# Altium schematic sheet SoftRobotController.SchDoc: Soft Robotic Actuator Controller
size B; DrawnBy: Logan Greif; Engineer: Logan Greif; SheetNumber: 1; SheetTotal: 1
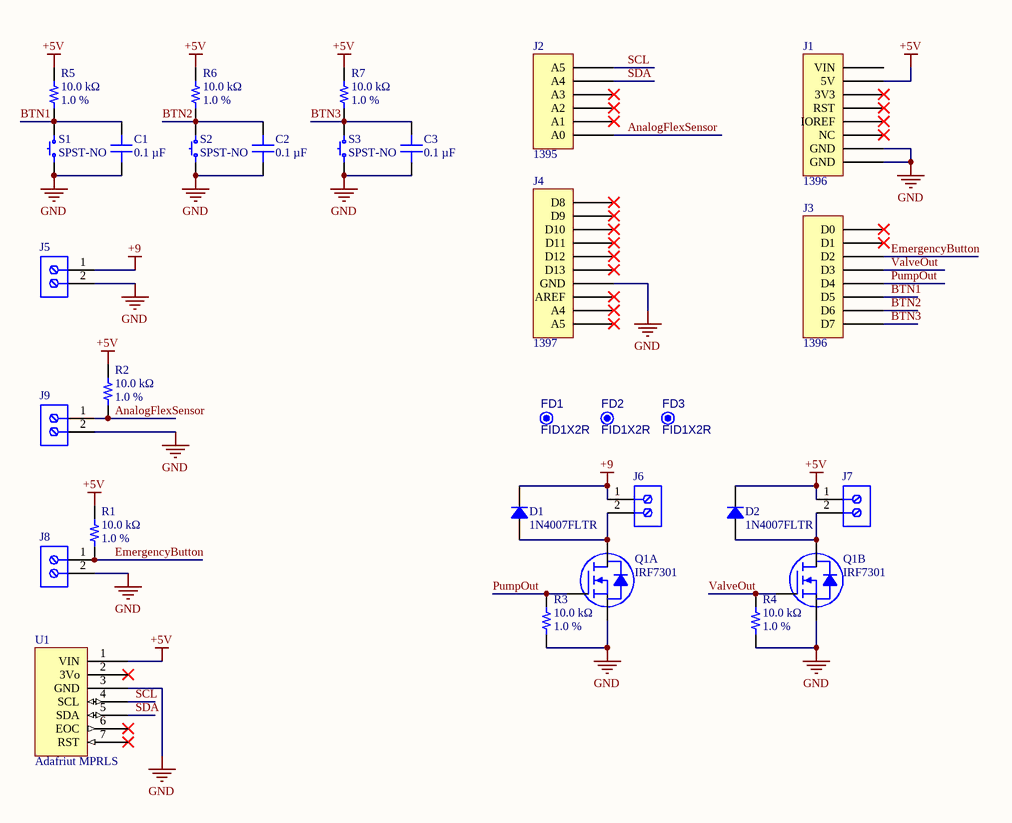
[diagram p0: SoftRobotController.SchDoc]

## Parts
C1  0.1 µF  [CAP 0603_1608]
C2  0.1 µF  [CAP 0603_1608]
C3  0.1 µF  [CAP 0603_1608]
D1  1N4007FLTR  [SOD123F]
D2  1N4007FLTR  [SOD123F]
FD1  FID1X2R  [FID1X2R]  (no BOM)
FD2  FID1X2R  [FID1X2R]  (no BOM)
FD3  FID1X2R  [FID1X2R]  (no BOM)
J1  1396  [PCB - CONNECTOR - HEADER - MALE 1X8]
J2  1395  [PCB - CONNECTOR - HEADER - MALE 1X6]
J3  1396  [PCB - CONNECTOR - HEADER - MALE 1X8]
J4  1397  [PCB - CONNECTOR - HEADER - MALE 1X10]
J5  691103110002  [691103110002]  (value not drawn)
J6  691103110002  [691103110002]  (value not drawn)
J7  691103110002  [691103110002]  (value not drawn)
J8  691103110002  [691103110002]  (value not drawn)
J9  691103110002  [691103110002]  (value not drawn)
Q1  IRF7301  [IRF7301]  (parts A,B of 2)
R1  10.0 kΩ  Tolerance: 1.0 %  [PCB - RESISTOR - CHIP - RES 0603_1608]
R2  10.0 kΩ  Tolerance: 1.0 %  [PCB - RESISTOR - CHIP - RES 0603_1608]
R3  10.0 kΩ  Tolerance: 1.0 %  [PCB - RESISTOR - CHIP - RES 0603_1608]
R4  10.0 kΩ  Tolerance: 1.0 %  [PCB - RESISTOR - CHIP - RES 0603_1608]
R5  10.0 kΩ  Tolerance: 1.0 %  [PCB - RESISTOR - CHIP - RES 0603_1608]
R6  10.0 kΩ  Tolerance: 1.0 %  [PCB - RESISTOR - CHIP - RES 0603_1608]
R7  10.0 kΩ  Tolerance: 1.0 %  [PCB - RESISTOR - CHIP - RES 0603_1608]
S1  SPST-NO  [PTS641SK31SMTR2LFS]
S2  SPST-NO  [PTS641SK31SMTR2LFS]
S3  SPST-NO  [PTS641SK31SMTR2LFS]
U1  Adafriut MPRLS  [ADAFRUITMPRLS]

## Nets
+5V: D2.2 J1.5(5V) J7.1 R1.2 R2.2 R5.2 R6.2 R7.2 U1.1(VIN)
+9: D1.2 J5.1 J6.1
GND: C1.1 C2.1 C3.1 J1.6(GND) J1.7(GND) J4.7(GND) J5.2 J8.2 J9.2 Q1.1(S1) Q1.3(S2) R3.1 R4.1 S1.1 S1.2 S2.1 S2.2 S3.1 S3.2 U1.3(GND)
AnalogFlexSensor: J2.6(A0) J9.1 R2.1
BTN1: C1.2 J3.6(D5) R5.1 S1.3 S1.4
BTN2: C2.2 J3.7(D6) R6.1 S2.3 S2.4
BTN3: C3.2 J3.8(D7) R7.1 S3.3 S3.4
EmergencyButton: J3.3(D2) J8.1 R1.1
PumpOut: J3.5(D4) Q1.2(G1) R3.2
SCL: J2.1(A5) U1.4(SCL)
SDA: J2.2(A4) U1.5(SDA)
ValveOut: J3.4(D3) Q1.4(G2) R4.2
NetD1_1: D1.1 J6.2 Q1.7(D1) Q1.8(D1)
NetD2_1: D2.1 J7.2 Q1.5(D2) Q1.6(D3)

Not connected (* = marked no-connect by the designer): J1 1(NC)* 2(IOREF)* 3(RST)* 4(3V3)* 8(VIN); J2 3(A3)* 4(A2)* 5(A1)*; J3 1(D0)* 2(D1)*; J4 1(D8)* 2(D9)* 3(D10)* 4(D11)* 5(D12)* 6(D13)* 8(AREF)* 9(A4)* 10(A5)*; U1 2(3Vo)* 6(EOC)* 7(RST)*

## Library data of the parts
C1-C3 = CS0603KRX7R7BB104: CAP CER 0.1UF 16V X7R 0603; manufacturer: Yageo; Tolerance: ±10%; Part Number: CS0603KRX7R7BB104; Value: 0.1 µF; Applications: Boardflex Sensitive; Capacitance: 0.1 µF; componentlink1description: Datasheet; componentlink1url: http://www.yageo.com/NewPortal/yageodocoutput?fileName=/pdf/MLCC/UPY-ST_NPOX7R_16V-to-3KV_5.pdf; componentlink2description: DigiKey Link; componentlink2url: https://www.digikey.com/en/products/detail/yageo/CS0603KRX7R7BB104/6097897; Device Package: 0603 (1608 Metric); Features: Soft Termination; lastupdated: 3/1/2023 8:07:52 PM; Lifecycle Status: Active; Minimum Order: 1; Mounting Type: Surface Mount, MLCC; Operating Temperature: -55°C ~ 125°C; Package / Case: 0603 (1608 Metric); packaging: TapeAndReel; partid: 2286; Part Status: Active; price: 0.01; series: CS; Size / Dimension: 0.063" L x 0.031" W (1.60mm x 0.80mm); Supplier 1: DigiKey; Supplier Part Number 1: 311-3560-1-ND; Temperature Coefficient: X7R; Thickness (Max): 0.037" (0.95mm); Voltage - Rated: 16V
D1 D2 = 1N4007FLTR: STANDARD RECTIFIER 1000V SOD-123; Manufacturer: SMC Diode Solutions; Capacitance @ Vr, F: 15pF @ 4V, 1MHz; Current - Average Rectified (Io): 1A; Current - Reverse Leakage @ Vr: 5µA @ 1000V; Speed: Standard Recovery >500ns, > 200mA (Io); Voltage - Forward (Vf) (Max) @ If: 1.1V @ 1A; Part Number: 1N4007FLTR; ComponentLink1Description: Datasheet; ComponentLink1URL: http://www.smc-diodes.com/propdf/1N4001FL-1N4007FL%20N1646%20REV.A.pdf; ComponentLink2Description: DigiKey Link; ComponentLink2URL: http://digikey.com/product-detail/en/smc-diode-solutions/1N4007FLTR/1655-1N4007FLCT-ND/11657827; Diode Type: Standard; LastUpdated: 8/30/2020 8:59:55 PM; Lifecycle Status: Active; Minimum Order: 1; Mounting Type: Surface Mount; Package / Case: SOD-123F; Packaging: TapeAndReel; PartId: 3314; Price: 0.01; Supplier 1: DigiKey; Supplier Part Number 1: 1655-1N4007FLCT-ND; Supplier Device Package: SOD-123FL; Voltage - DC Reverse (Vr) (Max): 1000V
FD1-FD3 = CMP-00028-00005-2: Fiducial - Round 1x2mm; Pins: 0
J1 J3 = CMP-002-00088-1: Connector Header Through Hole 8 position 0.100&quot; (2.54mm); Manufacturer: Sullins Connector Solutions; Manufacturer part number: PRPC008SAAN-RC; Number of Positions: 8; Male or Female: Male; Mounting Angle: Straight; Current Rating: 3.0 A; Connector Type: Header, Breakaway; Datasheet: https://media.digikey.com/PDF/Data%20Sheets/Sullins%20PDFs/xRxCzzzSxxN-RC_ST_11635-B.pdf; Category: Headers; Rowan Part Number: 1396; Number of Rows: 1; Material: Gold; Status: Active
J2 = CMP-002-00074-1: Connector Header Through Hole 6 position 0.100&quot; (2.54mm); Manufacturer: Sullins Connector Solutions; Manufacturer part number: PRPC006SAAN-RC; Mounting Angle: Straight; Current Rating: 3.0 A; Connector Type: Header, Breakaway; Male or Female: Male; Number of Positions: 6; Status: Active; Material: Gold; Datasheet: https://media.digikey.com/PDF/Data%20Sheets/Sullins%20PDFs/xRxCzzzSxxN-RC_ST_11635-B.pdf; Number of Rows: 1; Category: Headers; Rowan Part Number: 1395
J4 = CMP-002-00075-1: Connector Header Through Hole 10 position 0.100&quot; (2.54mm); Manufacturer: Sullins Connector Solutions; Manufacturer part number: PRPC010SAAN-RC; Male or Female: Male; Number of Positions: 10; Mounting Angle: Straight; Connector Type: Header, Breakaway; Current Rating: 3.0 A; Status: Active; Datasheet: https://media.digikey.com/PDF/Data%20Sheets/Sullins%20PDFs/xRxCzzzSxxN-RC_ST_11635-B.pdf; Material: Gold; Category: Headers; Rowan Part Number: 1397; Number of Rows: 1
J5-J9 = CMP-1502-03254-1: Series 1031 - 3.50 mm Horizontal Entry Modular with Pressure Clamp WR-TBL, 2 pin; Manufacturer: Wurth Elektronik; Pin Number: 2; Pitch: 3.50mm; Datasheet URL: http://katalog.we-online.de/em/datasheet/6911031100xx.pdf; Package Reference: 691103110002; Publisher: WurthElektronik; Manufacturer URL: http://www.we-online.de; Mounting Technology: THT; Operating Temperature: -40to105degC; Part Number: 691103110002; Packaging: Box
R1-R7 = 1416: 10 kOhms ±1% 0.1W, 1/10W Chip Resistor 0603 (1608 Metric) Moisture Resistant Thick Film; Rowan Part Number: 1416; Manufacturer: Yageo; Manufacturer part number: RC0603FR-0710KL; Name: 10.0 kΩ 100.0 mW 1.0 % Thick Film Resistor; Power: 100.0 mW; Supplier 1: Digi-Key; Supplier Part Number 1: 311-10.0KHRTR-ND; Category: Fixed; Datasheet: https://www.yageo.com/upload/media/product/productsearch/datasheet/rchip/PYu-RC_Group_51_RoHS_L_11.pdf; Status: Active; Packaging: Tape & Reel (TR); Package: 0603 (1608 Metric); Resistance: 10.0 kΩ; Composition: Thick Film
S1-S3 = PTS641SK31SMTR2LFS: Supplier 1: DigiKey; Supplier Part Number 1: CKN10810CT-ND
U1 = AdafruitMPRLS: Supplier Part Number 1: 1528-2713-ND; Supplier 1: DigiKey
Q1 = IRF7301: Supplier 1: DigiKey; Supplier Part Number 1: IRF7301PBFCT-ND